# EAGLE design LCDShieldC144MVGD 1.0 (EAGLE 5.11)

## Sheet 1 of 2
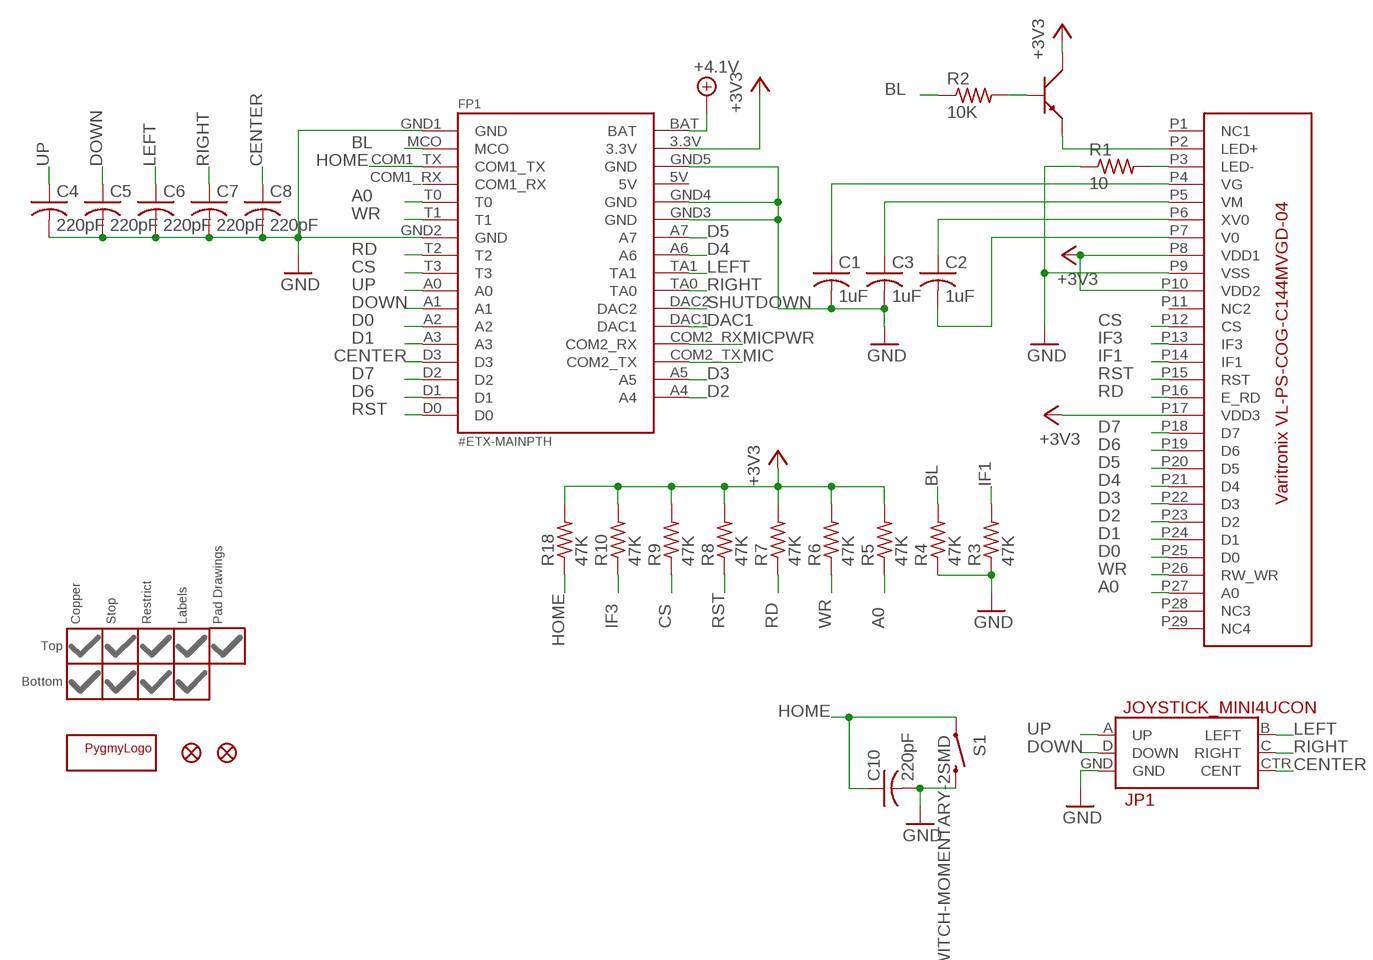
[diagram p0: schematic, sheet 1]

### Parts
C1  1uF  C-USC0402  [C0402]
C2  1uF  C-USC0402  [C0402]
C3  1uF  C-USC0402  [C0402]
C4  220pF  C-USC0402  [C0402]
C5  220pF  C-USC0402  [C0402]
C6  220pF  C-USC0402  [C0402]
C7  220pF  C-USC0402  [C0402]
C8  220pF  C-USC0402  [C0402]
C10  220pF  C-USC0402  [C0402]
FP1  #ETX-MAINPTH  [#ETX-HOLES]
JP1  JOYSTICK_MINI4UCON  [JOYSTICK_MINI]
JP2  FIDUCIAL1X2.5  [FIDUCIAL-1X2.5]
JP3  FIDUCIAL1X2.5  [FIDUCIAL-1X2.5]
R1  10  R-US_R0805  [R0805]
R2  10K  R-US_R0402  [R0402]
R3  47K  R-US_R0402  [R0402]
R4  47K  R-US_R0402  [R0402]
R5  47K  R-US_R0402  [R0402]
R6  47K  R-US_R0402  [R0402]
R7  47K  R-US_R0402  [R0402]
R8  47K  R-US_R0402  [R0402]
R9  47K  R-US_R0402  [R0402]
R10  47K  R-US_R0402  [R0402]
R18  47K  R-US_R0402  [R0402]
S1  SWITCH-MOMENTARY-2SMD  [SPARKFUN_TACTILE_SWITCH_SMD]
U1  VARITRONIX_VL-PS-COG-C144MVGD-04FOLDED  [VARITRONIX_C144MVGD_FOLDED]
U2  BIPOLAR-PMBT6428  [DUBLIB_SOT23]
U$3  #PYGMYLOGOTOPSILK  [#PYGMYLOGOTOP]

### Nets
+3V3: FP1.3.3V R5.2 R6.2 R7.2 R8.2 R9.2 R10.2 R18.2 U1.P8(VDD1) U1.P10(VDD2) U1.P17(VDD3) U2.3 ; also sheet 2
+4.1V: FP1.BAT ; also sheet 2
A0: FP1.T0 R5.1 U1.P27(A0)
BL: FP1.MCO R2.1 R4.2
CENTER: C8.1 FP1.D3 JP1.CTR(CENT)
CS: FP1.T3 R9.1 U1.P12(CS)
D0: FP1.A2 U1.P25(D0)
D1: FP1.A3 U1.P24(D1)
D2: FP1.A4 U1.P23(D2)
D3: FP1.A5 U1.P22(D3)
D4: FP1.A6 U1.P21(D4)
D5: FP1.A7 U1.P20(D5)
D6: FP1.D1 U1.P19(D6)
D7: FP1.D2 U1.P18(D7)
DAC1: FP1.DAC1 ; also sheet 2
DOWN: C5.1 FP1.A1 JP1.D(DOWN)
GND: C1.2 C3.2 C4.2 C5.2 C6.2 C7.2 C8.2 C10.2 FP1.GND1(GND) FP1.GND2(GND) FP1.GND3(GND) FP1.GND4(GND) FP1.GND5(GND) JP1.GND R1.1 R3.1 R4.1 S1.3 U1.P9(VSS) ; also sheet 2
HOME: C10.1 FP1.COM1_TX R18.1 S1.1
IF1: R3.2 U1.P14(IF1)
IF3: R10.1 U1.P13(IF3)
LEFT: C6.1 FP1.TA1 JP1.B(LEFT)
MIC: FP1.COM2_TX ; also sheet 2
MICPWR: FP1.COM2_RX ; also sheet 2
N$1: C1.1 U1.P4(VG)
N$2: C3.1 U1.P5(VM)
N$3: C2.1 U1.P6(XV0)
N$4: C2.2 U1.P7(V0)
N$5: R1.2 U1.P3(LED-)
N$6: U1.P2(LED+) U2.2
N$7: R2.2 U2.1
RD: FP1.T2 R7.1 U1.P16(E_RD)
RIGHT: C7.1 FP1.TA0 JP1.C(RIGHT)
RST: FP1.D0 R8.1 U1.P15(RST)
SHUTDOWN: FP1.DAC2 ; also sheet 2
UP: C4.1 FP1.A0 JP1.A(UP)
WR: FP1.T1 R6.1 U1.P26(RW_WR)
Unconnected: FP1.5V FP1.COM1_RX U1.P1(NC1) U1.P11(NC2) U1.P28(NC3) U1.P29(NC4)

## Sheet 2 of 2
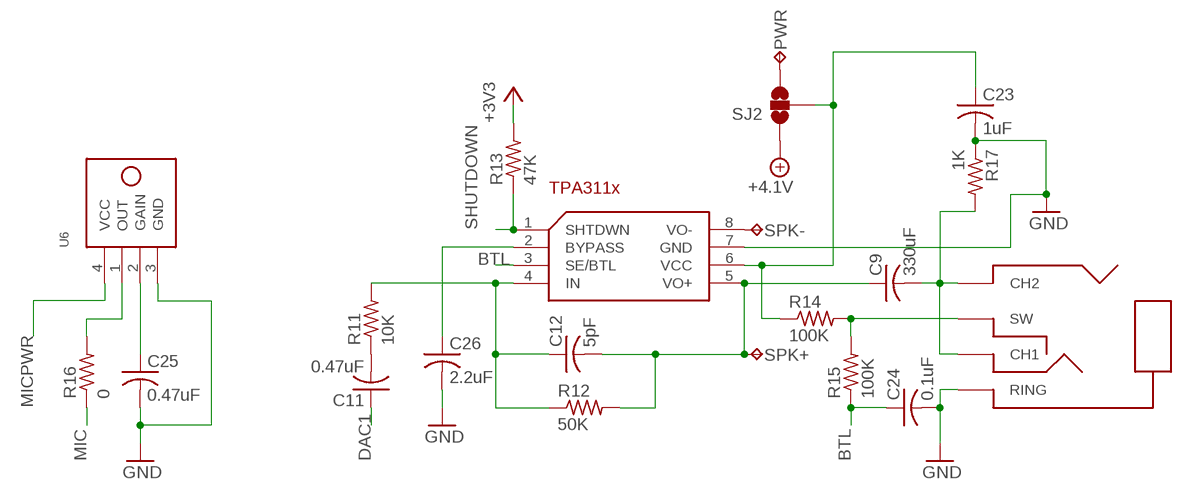
[diagram p1: schematic, sheet 2]

### Parts
C9  330uF  C-USC0402  [C0402]
C11  0.47uF  C-USC0402  [C0402]
C12  5pF  C-USC0402  [C0402]
C23  1uF  C-USC0402  [C0402]
C24  0.1uF  C-USC0402  [C0402]
C25  0.47uF  C-USC0402  [C0402]
C26  2.2uF  C-USC0402  [C0402]
PWR  TESTPAD_TPTESTPAD_PTH_STD  [TESTPAD_PTH_STD]
R11  10K  R-US_R0402  [R0402]
R12  50K  R-US_R0402  [R0402]
R13  47K  R-US_R0402  [R0402]
R14  100K  R-US_R0402  [R0402]
R15  100K  R-US_R0402  [R0402]
R16  0  R-US_R0402  [R0402]
R17  1K  R-US_R0402  [R0402]
SJ2  SOLDERJUMPER_2WAYS  [SJ_3]
SPK+  TESTPAD_TPTESTPAD_PTH_STD  [TESTPAD_PTH_STD]
SPK-  TESTPAD_TPTESTPAD_PTH_STD  [TESTPAD_PTH_STD]
U5  TPA311  [SO08]
U6  MIC_KNOWLES_SPM0408HE5H  [SPM0408HE5H]
U7  KOBICONN-161-4034-E-TOP  [KOBICONN-161-403X-E-TOP]

### Nets
+3V3: R13.2 ; also sheet 1
+4.1V: SJ2.1 ; also sheet 1
BTL: C24.1 R15.1 U5.3(SE/BTL)
DAC1: C11.1 ; also sheet 1
GND: C23.2 C24.2 C25.2 C26.2 R17.1 U5.7(GND) U6.3(GND) U7.P$1(RING) ; also sheet 1
MIC: R16.1 ; also sheet 1
MICPWR: U6.4(VCC) ; also sheet 1
N$8: R16.2 U6.1(OUT)
N$9: C12.1 R11.2 R12.1 U5.4(IN)
N$10: C23.1 R14.1 SJ2.2 U5.6(VCC)
N$17: PWR.P$1(TP) SJ2.3
N$18: C11.2 R11.1
N$19: C9.1 C12.2 R12.2 SPK+.P$1(TP) U5.5(VO+)
N$20: C9.2 R17.2 U7.P$2(CH1) U7.P$4(CH2)
N$21: C26.1 U5.2(BYPASS)
N$22: R14.2 R15.2 U7.P$3(SW)
N$23: SPK-.P$1(TP) U5.8(VO-)
N$24: C25.1 U6.2(GAIN)
SHUTDOWN: R13.1 U5.1(SHTDWN) ; also sheet 1

## Library data of the parts
C1-C12 C23-C26 = rcl:C-US: CAPACITOR, American symbol
FP1 = Pygmy:#ETX-MAIN: This is the only absolutely required part for the footprint It contains PTHs only. No "pretty pads".
JP1 = SparkFun:JOYSTICK_MINI
JP2 JP3 = SparkFun:FIDUCIAL: Fiducial Alignment Points Various fiducial points for machine vision alignment.
PWR SPK+ SPK- = Pygmy:TESTPAD_TP: Test pad
R1-R18 = rcl:R-US_: RESISTOR, American symbol
S1 = Pygmy:SWITCH-MOMENTARY-2
SJ2 = Pygmy:SOLDERJUMPER_2WAY: Solder Jumper 2 way solder jumper
U1 = Pygmy:VARITRONIX_VL-PS-COG-C144MVGD-04
U2 = Pygmy:BIPOLAR-PMBT6428
U5 = Pygmy:TPA311
U6 = Pygmy:MIC_KNOWLES_SPM0408HE5H: Knowles Acoustics Amplified Microphone
U7 = Pygmy:KOBICONN-161-4034-E-TOP
U$3 = Pygmy:#PYGMYLOGO

## Board
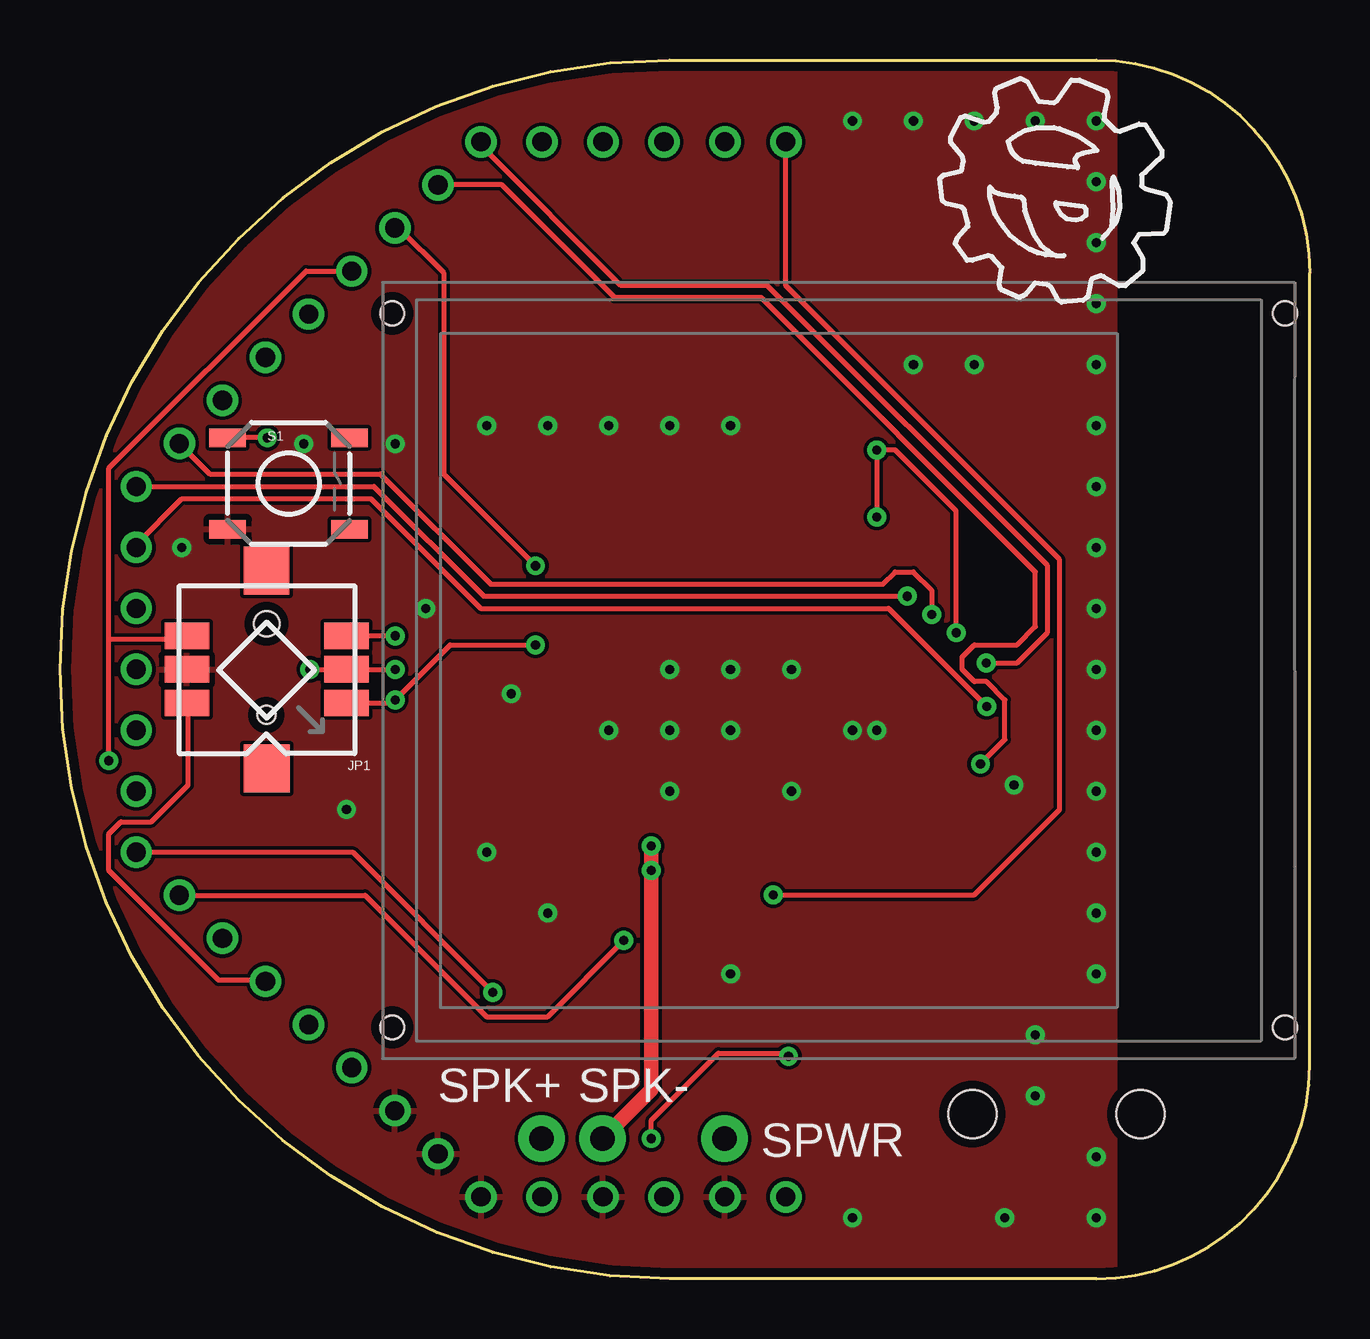
[diagram p2: board, top side]
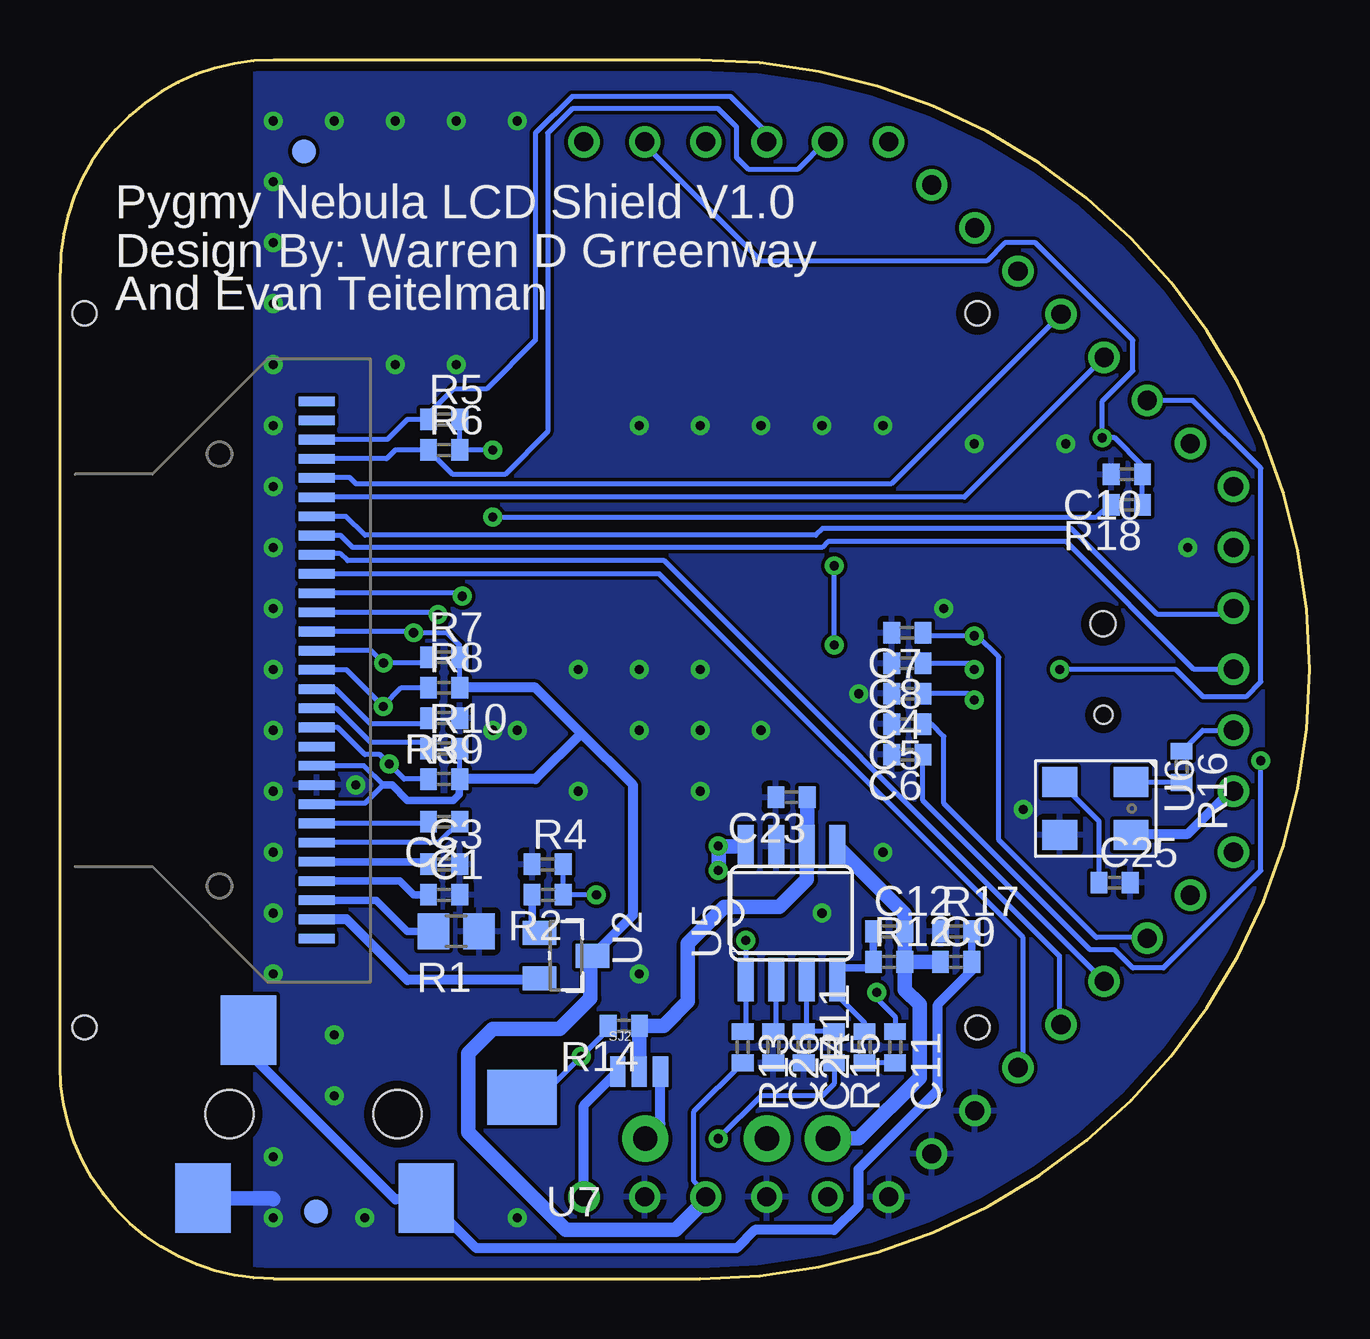
[diagram p3: board, bottom side, seen from below]

Size 52.07 x 50.8 mm. Coordinates in mm from the lower left corner, seen from the top.
Outline: 25.4,0 arc-180 25.4,50.8 43.18,50.8 arc-90 52.07,41.91 52.07,8.89 arc-90 43.18,0 25.4,0
Copper layers (1*16): Top 0.035mm / dielectric 1.5mm / Bottom 0.035mm
Design rules "PDX (Production)": minimum track width 6mil, minimum drill 15mil, track to track 6mil, track to pad 6mil, pad to pad 4mil, via to via 6mil, smd to smd 4mil, copper to edge 15mil, drill to drill 6mil, minimum pad ring 10mil, minimum via ring 8mil, stop-mask expansion 4mil, vias tented up to drill 25mil, thermal gap 10mil
bRestrict: area 0.5,22.1 to 1.8,30

### Footprints (pad centres in the part's own frame; a part is rotated, then mirrored left to right if it is on the bottom)
C0402 = smd 0.7 x 0.9: 1 -0.65,0; 2 0.65,0
#ETX-HOLES = drill 0.8 round: 3.3V -0.237,-21.988; 5V -5.316,-21.988; A0 -11.448,18.396; A1 -13.245,16.6; A2 -15.04,14.804; A3 -16.837,13.008; A4 -22.225,2.54; A5 -22.225,0; A6 -15.04,-14.804; A7 -13.245,-16.6; BAT 4.843,-21.988; COM1_RX -0.236,21.988; COM1_TX 2.304,21.988; COM2_RX -22.225,-5.08; COM2_TX -22.225,-2.54; D0 -22.225,5.08; D1 -22.225,7.62; D2 -20.429,9.416; D3 -18.633,11.212; DAC1 -22.225,-7.62; DAC2 -20.429,-9.416; GND1 -11.448,-18.396; GND2 -9.652,-20.192; GND3 -7.856,-21.988; GND4 -2.776,-21.988; GND5 2.303,-21.988; MCO 4.844,21.988; T0 -2.776,21.988; T1 -5.316,21.988; T2 -7.856,21.988; T3 -9.652,20.192; TA0 -18.633,-11.212; TA1 -16.837,-13.008
JOYSTICK_MINI = smd 1.85 x 1.1: A 0,2.8; B 6.65,2.8; C 0,0; CTR 0,1.4; D 6.65,0; GND 6.65,1.4 | smd 1.9 x 2: NC 3.325,5.53; NC@0 3.33,-2.72 | hole 0.75: 3.34,3.295 | hole 1.05: 3.325,-0.5
FIDUCIAL-1X2.5 = smd 1 x 1: 1 0,0
TESTPAD_PTH_STD = drill 1.016 pad 1.93 round: P$1 0,0
R0805 = smd 1.3 x 1.5: 1 -0.95,0; 2 0.95,0
R0402 = smd 0.7 x 0.9: 1 -0.65,0; 2 0.65,0
SPARKFUN_TACTILE_SWITCH_SMD = smd 1.524 x 0.762: 1 -2.54,1.905; 2 2.54,1.905; 3 -2.54,-1.905; 4 2.54,-1.905
SJ_3 = smd 0.635 x 1.27: 1 -0.889,0; 2 0,0; 3 0.889,0
VARITRONIX_C144MVGD_FOLDED = smd 0.4 x 1.5 bottom: P1 27.35,-10.06; P2 26.55,-10.06; P3 25.75,-10.06; P4 24.95,-10.06; P5 24.15,-10.06; P6 23.35,-10.06; P7 22.55,-10.06; P8 21.75,-10.06; P9 20.95,-10.06; P10 20.15,-10.06; P11 19.35,-10.06; P12 18.55,-10.06; P13 17.75,-10.06; P14 16.95,-10.06; P15 16.15,-10.06; P16 15.35,-10.06; P17 14.55,-10.06; P18 13.75,-10.06; P19 12.95,-10.06; P20 12.15,-10.06; P21 11.35,-10.06; P22 10.55,-10.06; P23 9.75,-10.06; P24 8.95,-10.06; P25 8.15,-10.06; P26 7.35,-10.06; P27 6.55,-10.06; P28 5.75,-10.06; P29 4.95,-10.06 | hole 1: 1.29,-0.39; 1.29,-37.59; 31.05,-37.59; 31.05,-0.39
DUBLIB_SOT23 = smd 1 x 1.4: 1 -0.95,-1.1; 2 0.95,-1.1; 3 0,1.1
SO08 = smd 0.66 x 1.8: 1 -1.905,-2.773; 2 -0.635,-2.773; 3 0.635,-2.773; 4 1.905,-2.773; 5 1.905,2.773; 6 0.635,2.773; 7 -0.635,2.773; 8 -1.905,2.773
SPM0408HE5H = smd 1.245 x 1.448: 1 -1.143,1.448; 2 -1.143,-1.524; 3 1.067,-1.524; 4 1.067,1.448
KOBICONN-161-403X-E-TOP = smd 2.3 x 2.9: P$1 -2.4,3.5; P$2 -11.7,3.5; P$4 -4.3,-3.5 | smd 2.9 x 2.3: P$3 -15.7,-0.7 | hole 2: -3.5,0; -10.5,0

### Placement (x,y rotation side)
C1  36.07,16 0 bottom
C2  36.07,19.05 180 bottom
C3  36.07,17.27 0 bottom
C4  16.76,24.38 180 bottom
C5  16.76,23.11 180 bottom
C6  16.76,21.84 180 bottom
C7  16.76,26.92 180 bottom
C8  16.76,25.65 180 bottom
C9  14.73,13.21 0 bottom
C10  7.62,33.53 180 bottom
C11  17.27,9.65 270 bottom
C12  17.53,14.48 0 bottom
C23  21.59,20.07 180 bottom
C24  21.08,9.65 270 bottom
C25  8.13,16.51 0 bottom
C26  22.35,9.65 270 bottom
FP1  25.4,25.4 0 top
JP1  11.94,26.8 180 top
JP2  41.91,46.99 0 bottom
JP3  41.4,2.79 0 bottom
PWR  27.69,5.84 0 top
R1  35.56,14.48 180 bottom
R2  31.75,16 180 bottom
R3  36.07,23.37 180 bottom
R4  31.75,17.27 0 bottom
R5  36.07,35.81 0 bottom
R6  36.07,34.54 0 bottom
R7  36.07,25.91 0 bottom
R8  36.07,24.64 0 bottom
R9  36.07,20.83 0 bottom
R10  36.07,22.1 0 bottom
R11  18.54,9.65 90 bottom
R12  17.53,13.21 0 bottom
R13  23.62,9.65 270 bottom
R14  28.57,10.54 180 bottom
R15  19.81,9.65 270 bottom
R16  5.33,21.34 270 bottom
R17  14.73,14.48 0 bottom
R18  7.62,32.26 180 bottom
S1  9.53,33.15 0 top
SJ2  27.94,8.64 0 bottom
SPK+  20.07,5.84 0 top
SPK-  22.61,5.84 0 top
U1  51.44,41.53 270 top
U2  30.99,13.46 270 bottom
U5  21.59,15.24 0 bottom
U6  8.89,19.56 270 bottom
U7  48.51,6.86 180 bottom
U$3  41.15,45.97 270 top

### Tracks (layer width: path | path; a pad name or v marks a point on that pad's centre or on a via)
+3V3  (via drill 0.38)
  Top 0.203: v37.34,26.92 37.34,32 34.8,34.54 v34.04,34.54 v34.04,31.75
  Bottom 0.203: R8.2 R7.2 35.43,25.92 35.43,26.42 35.94,26.92 v37.34,26.92 37.39,26.98 U1.P17 | U1.P10 39.41,21.38 38.61,20.57 39.37,19.81 41.34,19.81 U1.P8 | R5.2 R6.2 v34.04,34.54 | R9.2 R10.2 | FP1.3.3V 25.16,3.57 25.65,4.06 25.65,6.97 R13.2 | R18.2 8.38,32.26 8.89,31.75 v34.04,31.75
  Bottom 0.305: 38.61,20.57 38.23,20.57 37.59,19.94 35.69,19.94 35.43,20.19 35.43,20.81 R9.2
  Bottom 0.406: R8.2 32.26,24.64 30.35,22.73 | 30.35,22.73 28.19,20.57 28.19,15.16 U2.3 | R9.2 32.26,20.83 30.35,22.73
  Bottom 0.61: FP1.3.3V 25.16,3.29 26.42,2.03 30.99,2.03 35.05,6.1 35.05,9.4 34.04,10.41 31.24,10.41 29.97,11.68 29.97,13.38 U2.3
+4.1V
  Bottom 0.406: FP1.BAT 30.24,7.22 SJ2.1
A0
  Bottom 0.203: FP1.T0 22.62,47.77 24.13,49.28 30.73,49.28 32.26,47.75 32.26,39.12 34.29,37.08 35.69,37.08 36.7,36.07 36.7,35.83 R5.1 37.59,35.81 38.43,34.98 U1.P27
BL  (via drill 0.38)
  Top 0.203: FP1.MCO 30.24,41.38 41.66,29.97 41.66,19.56 38.1,16 v29.72,16
  Bottom 0.203: v29.72,16 R2.1 R4.2
BTL
  Bottom 0.203: R15.1 C24.1 20.95,10.18 U5.3
CENTER  (via drill 0.38)
  Top 0.203: v13.97,25.4 JP1.CTR v10.41,25.4
  Bottom 0.203: v13.97,25.4 14.22,25.65 C8.1 | FP1.D3 4.86,36.61 2.03,33.78 2.03,24.89 2.67,24.26 4.45,24.26 5.59,25.4 v10.41,25.4
CS  (via drill 0.38)
  Top 0.203: FP1.T3 18.42,45.59 23.11,40.89 29.21,40.89 40.64,29.46 40.64,27.18 39.88,26.42 38.1,26.42 37.59,25.91 37.59,25.4 38.1,24.89 38.61,24.89 39.37,24.13 39.37,22.47 v38.35,21.45
  Bottom 0.203: R9.1 37.73,20.83 v38.35,21.45 38.74,21.84 39.37,21.84 40.51,22.98 U1.P12
D0
  Bottom 0.203: FP1.A2 17.44,33.12 39.73,33.12 40.01,33.4 41.35,33.4 U1.P25
D1
  Bottom 0.203: FP1.A3 14.39,32.58 U1.P24
D2
  Bottom 0.203: U1.P23 40.16,31.78 39.37,30.99 20.57,30.99 20.29,31.27 9.94,31.27 6.35,27.69 3.43,27.69 FP1.A4
D3
  Bottom 0.203: U1.P22 40.38,30.98 39.88,30.48 20.32,30.48 20.07,30.73 10.15,30.73 4.83,25.4 FP1.A5
D4
  Bottom 0.203: FP1.A6 10.41,10.65 10.41,13.46 10.43,13.46 26.89,29.93 40.09,29.93 40.39,30.23 41.33,30.23 U1.P21
D5
  Bottom 0.203: U1.P20 27.09,29.38 11.94,14.22 11.94,9.02 FP1.A7
D6  (via drill 0.38)
  Top 0.203: v35.31,28.45 17.65,28.45 13.08,33.02 FP1.D1
  Bottom 0.203: U1.P19 35.44,28.58 v35.31,28.45
D7  (via drill 0.38)
  Top 0.203: v36.32,27.69 36.32,28.7 35.56,29.46 34.8,29.46 34.29,28.96 17.94,28.96 13.35,33.55 6.24,33.55 FP1.D2 5.06,34.82
  Bottom 0.203: U1.P18 36.41,27.78 v36.32,27.69
DAC1  (via drill 0.38)
  Top 0.203: FP1.DAC1 12.19,17.78 v18.03,11.94
  Bottom 0.203: v18.03,11.94 18.03,11.68 17.27,10.92 C11.1
DOWN  (via drill 0.38)
  Top 0.203: FP1.A1 10.25,42 2.03,33.78 2.03,26.67 | v2.03,21.59 2.03,26.67 | JP1.D 5.21,26.8 5.08,26.67 2.03,26.67
  Bottom 0.203: C5.1 15.75,23.11 15.24,22.61 15.24,19.81 9.14,13.72 8.13,13.72 7.37,12.95 6.1,12.95 2.03,17.02 v2.03,21.59
GND  (via drill 0.38)
  Bottom 0.61: U7.P$1 43.24,3.36 43.18,3.3
  other vias: 34.04,22.86 33.02,22.86 39.75,20.57 13.97,34.8 22.86,35.56 27.94,35.56 40.64,10.16 22.86,22.86 39.37,2.54 43.18,2.54 43.18,5.08 17.78,17.78 18.8,24.38 43.18,12.7 33.02,48.26 35.56,48.26 38.1,48.26 40.64,48.26 43.18,48.26 43.18,45.72 43.18,43.18 43.18,40.64 43.18,38.1 43.18,35.56 43.18,33.02 43.18,30.48 43.18,27.94 43.18,25.4 43.18,22.86 43.18,20.32 43.18,17.78 43.18,15.24 11.94,19.56 33.02,2.54 40.64,7.62 20.32,15.24 27.94,12.7 30.48,20.32 25.4,20.32 25.4,22.86 27.94,22.86 10.16,34.8 15.24,27.94 17.78,35.56 20.32,35.56 25.4,35.56 25.4,25.4 27.94,25.4 30.48,25.4 38.1,38.1 35.56,38.1 5.08,30.48
  pour Bottom: -5.08,56.39 43.94,56.39 43.94,-5.08 -5.08,-5.08
  pour Top: -1.78,52.83 43.94,52.83 43.94,-1.52 -1.78,-1.52
HOME  (via drill 0.38)
  Top 0.203: v8.64,35.05 S1.1
  Bottom 0.203: FP1.COM1_TX 27.7,47.26 22.86,42.42 13.46,42.42 12.7,43.18 11.43,43.18 7.37,39.12 7.37,37.85 8.64,36.58 v8.64,35.05 8.13,35.05 6.97,33.89 C10.1 R18.1
IF1
  Bottom 0.203: U1.P14 40.58,24.58 39.12,23.11 36.97,23.11 R3.2
IF3
  Bottom 0.203: U1.P13 40.54,23.78 39.12,22.35 36.97,22.35 R10.1
LEFT
  Top 0.203: JP1.B 5.33,23.95 5.33,20.57 3.81,19.05 2.54,19.05 2.03,18.54 2.03,17.02 6.6,12.45 8.51,12.45 FP1.TA1
  Bottom 0.203: C6.1 16.11,19.94 FP1.TA1
MIC
  Bottom 0.203: FP1.COM2_TX 4.46,22.86 R16.1
MICPWR
  Bottom 0.406: FP1.COM2_RX 3.3,20.32 5.08,18.54 7.39,18.54 U6.4
N$1
  Bottom 0.305: U1.P4 37.91,16.58 37.34,16 C1.1
N$2
  Bottom 0.305: U1.P5 36.72,17.38 C3.1
N$3
  Bottom 0.203: U1.P6 36.29,18.18 C2.1
N$4
  Bottom 0.203: U1.P7 36.79,18.98 C2.2
N$5
  Bottom 0.305: U1.P3 38.89,15.78 37.59,14.48 R1.2
N$6
  Bottom 0.406: U1.P2 40.12,14.98 37.59,12.45 32.15,12.45 U2.2
N$7
  Bottom 0.203: 32.4,14.47 32.15,14.47 U2.1
  Bottom 0.305: 32.4,14.47 R2.2
N$8
  Bottom 0.203: U6.1 5.35,20.7 R16.2
N$9
  Bottom 0.203: U5.4 19.68,11.81 18.54,10.67 R11.2
  Bottom 0.305: U5.4 19.68,12.83 19.56,12.95 18.43,12.95 R12.1 C12.1
N$10
  Bottom 0.406: R14.1 27.94,10.53 | U5.6 20.94,18.03
  Bottom 0.61: 27.94,10.53 SJ2.2 | U5.6 20.95,16.64 22.1,15.49 24.38,15.49 25.91,13.97 25.91,11.56 26.92,10.54 R14.1 | 20.94,18.03 C23.1
N$17
  Bottom 0.406: SJ2.3 27.05,6.48 PWR.P$1
N$18
  Bottom 0.203: C11.2 R11.1
N$19
  Bottom 0.61: R12.2 C12.2 16.88,15.2 U5.5 | R12.2 C9.1 | R12.2 16.88,12.05 16.26,11.43 16.26,8.38 18.8,5.84 SPK+.P$1
N$20
  Bottom 0.305: C9.2 R17.2
  Bottom 0.406: 44.21,9.42 38.1,3.3 36.87,3.3 | C9.2 14.08,12.84 15.49,11.43 15.49,7.87 18.8,4.57 18.8,3.05 19.81,2.03 23.11,2.03 23.88,1.27 34.73,1.27 U7.P$2
  Bottom 0.61: 44.21,9.42 U7.P$4 | U7.P$2 36.87,3.3
N$21
  Bottom 0.203: U5.2 22.23,10.18 C26.1
N$22  (via drill 0.38)
  Top 0.203: v24.64,5.84 24.64,6.6 27.43,9.4 30.23,9.4 v30.35,9.27
  Bottom 0.203: R14.2 29.23,10.4 v30.35,9.27 32.07,7.56 U7.P$3 | R15.2 19.81,8.13 20.32,7.62 22.86,7.62 v24.64,5.84
N$23  (via drill 0.38)
  Top 0.61: v24.64,18.03 24.64,7.87 SPK-.P$1
  Bottom 0.61: 24.62,18.01 U5.8 | v24.64,18.03 24.62,18.01 | 24.62,18.01 24.62,17.04 v24.64,17.02
N$24
  Bottom 0.203: C25.1 8.78,19.07 U6.2
RD  (via drill 0.38)
  Top 0.203: FP1.T2 17.54,47.23 23.37,41.4 29.46,41.4 41.15,29.72 41.15,26.94 39.88,25.67 v38.59,25.67
  Bottom 0.203: U1.P16 39.1,26.18 v38.59,25.67 36.95,25.67 R7.1
RIGHT  (via drill 0.38)
  Top 0.203: v13.97,26.8 JP1.C
  Bottom 0.203: FP1.TA0 6.82,14.19 6.86,14.22 8.89,14.22 12.95,18.29 12.95,25.91 13.84,26.8 v13.97,26.8 15.99,26.8 C7.1
RST  (via drill 0.38)
  Top 0.203: v38.61,23.86 34.52,27.94 17.53,27.94 12.95,32.51 5.08,32.51 3.17,30.61 FP1.D0
  Bottom 0.203: U1.P15 40.13,25.38 v38.61,23.86 38.61,23.88 37.85,24.64 R8.1
SHUTDOWN  (via drill 0.38)
  Top 0.203: FP1.DAC2 12.72,15.98 17.78,10.92 20.32,10.92 v23.5,14.1
  Bottom 0.203: R13.1 23.5,10.18 U5.1 v23.5,14.1
UP  (via drill 0.38)
  Top 0.203: JP1.A 13.84,24 v13.97,24.13 16.26,26.42 v19.81,26.42 | FP1.A0 14.12,43.8 16,41.91 16,33.53 v19.81,29.72
  Bottom 0.203: v13.97,24.13 14.22,24.38 C4.1 | v19.81,26.42 v19.81,29.72
WR
  Bottom 0.203: FP1.T1 20.18,47.39 21.34,46.23 23.37,46.23 23.88,46.74 23.88,48.01 24.64,48.77 30.73,48.77 31.75,47.75 31.75,35.31 33.53,33.53 35.7,33.53 R6.1 38.1,34.54 38.47,34.18 U1.P26

### Text on the board
Document: Pygmy LCD Shield | Version 1.0 | Standard Grid: 50mil | Routing Grids: 8mil / 4mil | Released under the Creative Commons Attributions Share-Alike 3.0 License | http://creativecommons.org/licenses/by-sa/3.0 | Design by: Warren D Greenway and Evan Teitelman
_tsilk: SPK+ | SPK- | SPWR
_bsilk: Pygmy Nebula LCD Shield V1.0 | Design By: Warren D Grreenway | And Evan Teitelman